# Altium schematic sheet TC364_MainBoard_Core_V2.0.SchDoc
size A4
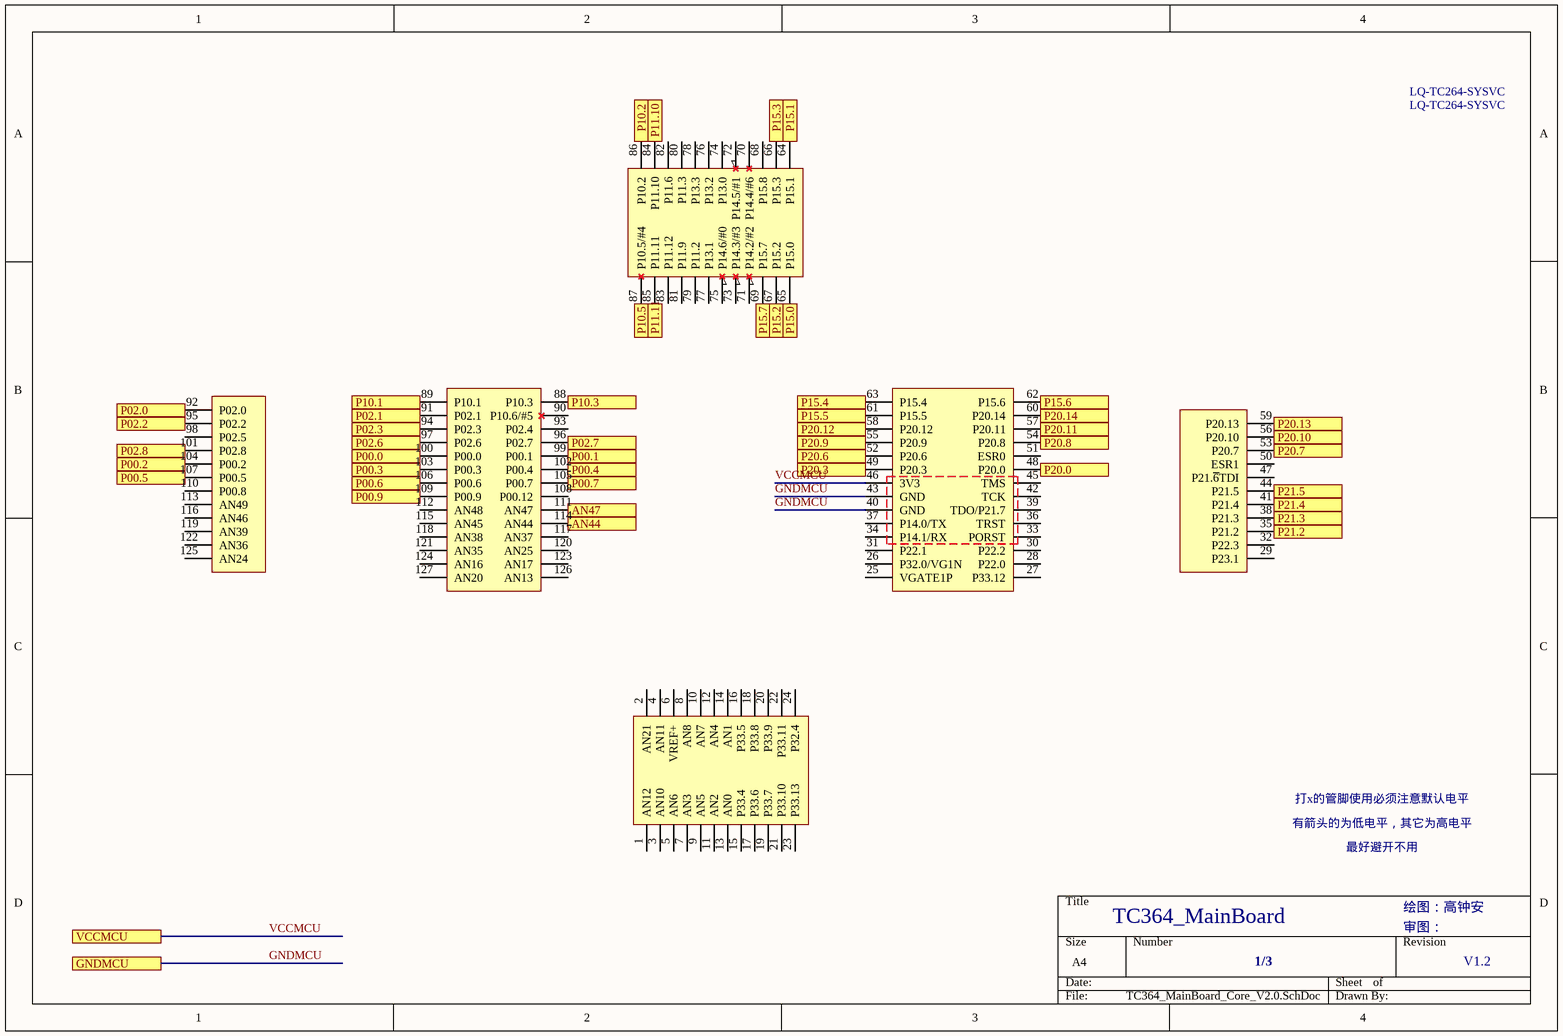
[diagram p0: TC364_MainBoard_Core_V2.0.SchDoc]

## Parts
LQ-TC264-SYSVC  LQ-TC264-SYSVC  [TC364V1.2]

## Ports
AN44, AN47, GNDMCU, P00.0, P00.1, P00.2, P00.3, P00.4, P00.5, P00.6, P00.7, P00.9, P02.0, P02.1, P02.2, P02.3, P02.6, P02.7, P02.8, P10.1, P10.2, P10.3, P10.5, P11.10, P11.11, P15.0, P15.1, P15.2, P15.3, P15.4, P15.5, P15.6, P15.7, P20.0, P20.3, P20.6, P20.7, P20.8, P20.9, P20.10, P20.11, P20.12, P20.13, P20.14, P21.2, P21.3, P21.4, P21.5, VCCMCU

## Nets
AN44: LQ-TC264-SYSVC.114(AN44) ; port AN44
AN47: LQ-TC264-SYSVC.111(AN47) ; port AN47
GNDMCU: LQ-TC264-SYSVC.40(GND) LQ-TC264-SYSVC.43(GND) ; port GNDMCU
P00.0: LQ-TC264-SYSVC.100(P00.0) ; port P00.0
P00.1: LQ-TC264-SYSVC.99(P00.1) ; port P00.1
P00.2: LQ-TC264-SYSVC.104(P00.2) ; port P00.2
P00.3: LQ-TC264-SYSVC.103(P00.3) ; port P00.3
P00.4: LQ-TC264-SYSVC.102(P00.4) ; port P00.4
P00.5: LQ-TC264-SYSVC.107(P00.5) ; port P00.5
P00.6: LQ-TC264-SYSVC.106(P00.6) ; port P00.6
P00.7: LQ-TC264-SYSVC.105(P00.7) ; port P00.7
P00.9: LQ-TC264-SYSVC.109(P00.9) ; port P00.9
P02.0: LQ-TC264-SYSVC.92(P02.0) ; port P02.0
P02.1: LQ-TC264-SYSVC.91(P02.1) ; port P02.1
P02.2: LQ-TC264-SYSVC.95(P02.2) ; port P02.2
P02.3: LQ-TC264-SYSVC.94(P02.3) ; port P02.3
P02.6: LQ-TC264-SYSVC.97(P02.6) ; port P02.6
P02.7: LQ-TC264-SYSVC.96(P02.7) ; port P02.7
P02.8: LQ-TC264-SYSVC.101(P02.8) ; port P02.8
P10.1: LQ-TC264-SYSVC.89(P10.1) ; port P10.1
P10.2: LQ-TC264-SYSVC.86(P10.2) ; port P10.2
P10.3: LQ-TC264-SYSVC.88(P10.3) ; port P10.3
P10.5: LQ-TC264-SYSVC.87(P10.5/#4) ; port P10.5
P11.10: LQ-TC264-SYSVC.84(P11.10) ; port P11.10
P11.11: LQ-TC264-SYSVC.85(P11.11) ; port P11.11
P15.0: LQ-TC264-SYSVC.65(P15.0) ; port P15.0
P15.1: LQ-TC264-SYSVC.64(P15.1) ; port P15.1
P15.2: LQ-TC264-SYSVC.67(P15.2) ; port P15.2
P15.3: LQ-TC264-SYSVC.66(P15.3) ; port P15.3
P15.4: LQ-TC264-SYSVC.63(P15.4) ; port P15.4
P15.5: LQ-TC264-SYSVC.61(P15.5) ; port P15.5
P15.6: LQ-TC264-SYSVC.62(P15.6) ; port P15.6
P15.7: LQ-TC264-SYSVC.69(P15.7) ; port P15.7
P20.0: LQ-TC264-SYSVC.48(P20.0) ; port P20.0
P20.3: LQ-TC264-SYSVC.49(P20.3) ; port P20.3
P20.6: LQ-TC264-SYSVC.52(P20.6) ; port P20.6
P20.7: LQ-TC264-SYSVC.53(P20.7) ; port P20.7
P20.8: LQ-TC264-SYSVC.54(P20.8) ; port P20.8
P20.9: LQ-TC264-SYSVC.55(P20.9) ; port P20.9
P20.10: LQ-TC264-SYSVC.56(P20.10) ; port P20.10
P20.11: LQ-TC264-SYSVC.57(P20.11) ; port P20.11
P20.12: LQ-TC264-SYSVC.58(P20.12) ; port P20.12
P20.13: LQ-TC264-SYSVC.59(P20.13) ; port P20.13
P20.14: LQ-TC264-SYSVC.60(P20.14) ; port P20.14
P21.2: LQ-TC264-SYSVC.35(P21.2) ; port P21.2
P21.3: LQ-TC264-SYSVC.38(P21.3) ; port P21.3
P21.4: LQ-TC264-SYSVC.41(P21.4) ; port P21.4
P21.5: LQ-TC264-SYSVC.44(P21.5) ; port P21.5
VCCMCU: LQ-TC264-SYSVC.46(3V3) ; port VCCMCU

Not connected (* = marked no-connect by the designer): LQ-TC264-SYSVC 1(AN12) 2(AN21) 3(AN10) 4(AN11) 5(AN6) 6(VREF+) 7(AN3) 8(AN8) 9(AN5) 10(AN7) 11(AN2) 12(AN4) 13(AN0) 14(AN1) 15(P33.4) 16(P33.5) 17(P33.6) 18(P33.8) 19(P33.7) 20(P33.9) 21(P33.10) 22(P33.11) 23(P33.13) 24(P32.4) 25(VGATE1P) 26(P32.0/VG1N) 27(P33.12) 28(P22.0) 29(P23.1) 30(P22.2) 31(P22.1) 32(P22.3) 33(PORST) 34(P14.1/RX) 36(TRST) 37(P14.0/TX) 39(TDO/P21.7) 42(TCK) 45(TMS) 47(P21.~{6}TDI) 50(ESR1) 51(ESR0) 68(P15.8) 70(P14.4/#6) 71(P14.2/#2) 72(P14.5/#1) 73(P14.3/#3) 74(P13.0) 75(P14.6/#0) 76(P13.2) 77(P13.1) 78(P13.3) 79(P11.2) 80(P11.3) 81(P11.9) 82(P11.6) 83(P11.12) 90(P10.6/#5) 93(P02.4) 98(P02.5) 108(P00.12) 110(P00.8) 112(AN48) 113(AN49) 115(AN45) 116(AN46) 117(AN37) 118(AN38) 119(AN39) 120(AN25) 121(AN35) 122(AN36) 123(AN17) 124(AN16) 125(AN24) 126(AN13) 127(AN20)

## Notes on the sheet
- TC364_MainBoard
- 绘图：高钟安
- 1/3
- 审图：
- V1.2
- (in symbol LQ-TC264-SYSVC) 打x的管脚使用必须注意默认电平; 有箭头的为低电平，其它为高电平; 最好避开不用